# EAGLE design MStar-WLAN (EAGLE 9.6.2)
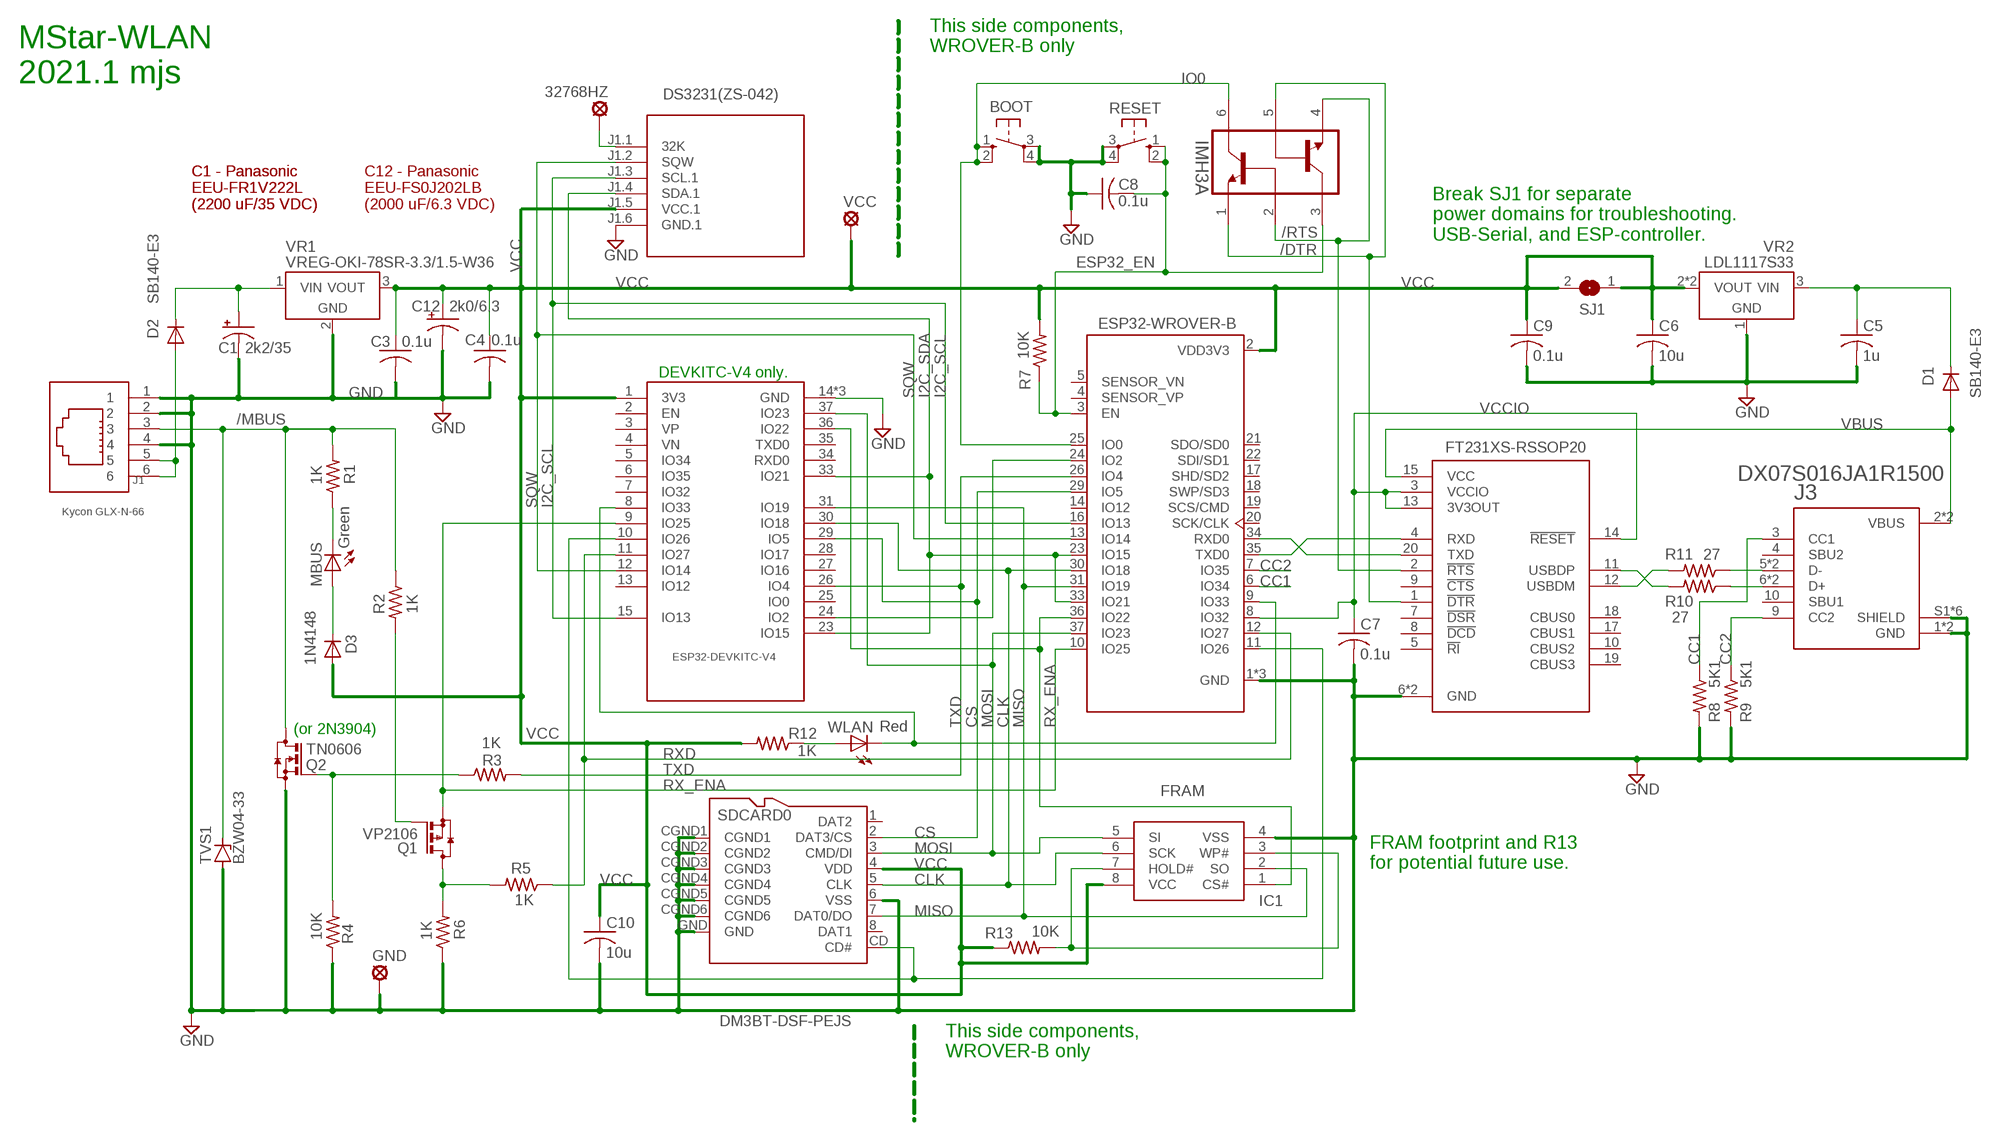
[diagram p0: schematic, sheet 1]

## Parts
32768HZ  MCS10B  [MCS10B]
BOOT  PTS645SM432LFS  10-XX  [B3F-10XX]
C1  2k2/35  CPOL-USE5-4  [E5-4]
C3  0.1u  C-US025-024X044  [C025-024X044]
C4  0.1u  C-US025-024X044  [C025-024X044]
C5  1u  C-USC1206  [C1206]
C6  10u  C-USC1206  [C1206]
C7  0.1u  C-US025-024X044  [C025-024X044]
C8  0.1u  C-US025-024X044  [C025-024X044]
C9  0.1u  C-US025-024X044  [C025-024X044]
C10  10u  C-USC1206  [C1206]
C12  2k0/6.3  CPOL-USE5-6  [E5-6]
D1  SB140-E3  DIODE-DO41-7.6  [DO41-7.6]
D2  SB140-E3  DIODE-DO41-7.6  [DO41-7.6]
D3  1N4148  1N4148DO35-7  [DO35-7]
DS3231(ZS-042)  RTC-DS3231-AT24C32-6  [RTC-DS3231-AT24C32-6]
ESP32-WROVER-B  ESP32-WROVER-I  [XCVR_ESP32-WROVER-I]
FT231XS  FT231XS-RSSOP20  [SSOP20]
GND  MCS10B  [MCS10B]
IC1  FRAM  MR45V100AMAZAATLSO8M  [SO-08M]
IMH3A  IMH3ATSOP6  [TSOP6]
J1  Kycon GLX-N-66  6P6C  [6P6C]
J3  DX07S016JA1R1500  [JAE_DX07S016JA1R1500]
MBUS  Green  LED3MM  [LED3MM]
Q1  VP2106  [TO92]
Q2  TN0606  [TO92]
R1  1K  R-US_  [0204/5]
R2  1K  R-US_  [0204/5]
R3  1K  R-US_  [0204/5]
R4  10K  R-US_  [0204/5]
R5  1K  R-US_  [0204/5]
R6  1K  R-US_  [0204/5]
R7  10K  R-US_  [0204/5]
R8  5K1  R-US_  [0204/5]
R9  5K1  R-US_  [0204/5]
R10  27  R-US_  [0204/5]
R11  27  R-US_  [0204/5]
R12  1K  R-US_  [0204/5]
R13  10K  R-US_R1206  [R1206]
RESET  PTS645SM432LFS  10-XX  [B3F-10XX]
SDCARD0  DM3BT-DSF-PEJS  [DM3BT-DSF-PEJS]
SJ1  SJ  [SJ]
TVS1  BZW04-33  ZPY  [DO41Z10]
U$1  ESP32-DEVKITC-V4-NOSD  [ESP32-DEVKITC-V4-NOSD]
VCC  MCS10B  [MCS10B]
VR1  VREG-OKI-78SR-3.3/1.5-W36  [OKI-78SR]
VR2  LDL1117S33  VREG-TS1117CW-3V3  [SOT223]
WLAN  Red  LED3MM  [LED3MM]

## Nets
/DTR: FT231XS.1(!DTR) IMH3A.1(Q1E) IMH3A.5(Q2B)
/MBUS: J1.3 Q2.D R1.2 R2.1 TVS1.C
/RTS: FT231XS.2(!RTS) IMH3A.2(Q1B) IMH3A.4(Q2E)
CC1: ESP32-WROVER-B.6(IO34) J3.3(CC1) R8.1
CC2: ESP32-WROVER-B.7(IO35) J3.9(CC2) R9.1
CD: ESP32-WROVER-B.11(IO26) SDCARD0.CD(CD#) U$1.10(IO26)
CLK: ESP32-WROVER-B.30(IO18) IC1.6(SCK) SDCARD0.5(CLK) U$1.30(IO18)
CS: ESP32-WROVER-B.29(IO5) SDCARD0.2(DAT3/CS) U$1.29(IO5)
ESP32_EN: C8.2 ESP32-WROVER-B.3(EN) IMH3A.3(Q2C) R7.1 RESET.1(S) RESET.2(S1)
GND [PWR]: BOOT.3(P) BOOT.4(P1) C1.- C3.2 C4.2 C5.2 C6.2 C7.2 C8.1 C9.2 C10.2 C12.- DS3231(ZS-042).J1.6(GND.1) ESP32-WROVER-B.1(GND) ESP32-WROVER-B.15(GND) ESP32-WROVER-B.38(GND) FT231XS.6(GND) FT231XS.16(GND) GND.MP IC1.4(VSS) J1.1 J1.2 J1.4 J3.1(GND) J3.12(GND) J3.S1(SHIELD) J3.S2(SHIELD) J3.S3(SHIELD) J3.S4(SHIELD) J3.S5(SHIELD) J3.S6(SHIELD) Q2.S R4.1 R6.1 R8.2 R9.2 RESET.3(P) RESET.4(P1) SDCARD0.6(VSS) SDCARD0.CGND1 SDCARD0.CGND2 SDCARD0.CGND3 SDCARD0.CGND4 SDCARD0.CGND5 SDCARD0.CGND6 SDCARD0.GND TVS1.A U$1.14(GND) U$1.32(GND) U$1.38(GND) VR1.2(GND) VR2.1(GND)
I2C_SCL: DS3231(ZS-042).J1.3(SCL.1) ESP32-WROVER-B.16(IO13) U$1.15(IO13)
I2C_SDA: DS3231(ZS-042).J1.4(SDA.1) ESP32-WROVER-B.23(IO15) ESP32-WROVER-B.33(IO21) U$1.23(IO15) U$1.33(IO21)
IO0: BOOT.1(S) BOOT.2(S1) ESP32-WROVER-B.25(IO0) IMH3A.6(Q1C)
MISO: ESP32-WROVER-B.31(IO19) IC1.2(SO) SDCARD0.7(DAT0/DO) U$1.31(IO19)
MOSI: ESP32-WROVER-B.37(IO23) IC1.5(SI) SDCARD0.3(CMD/DI) U$1.37(IO23)
N$1: MBUS.K(C) R1.1
N$2: Q2.G R3.1 R4.2
N$3: Q1.G R2.2
N$5: 32768HZ.MP DS3231(ZS-042).J1.1(32K)
N$6: ESP32-WROVER-B.36(IO22) IC1.1(CS#) U$1.36(IO22)
N$7: IC1.3(WP#) IC1.7(HOLD#) R13.2
N$8: D3.C MBUS.A
N$9: ESP32-WROVER-B.24(IO2) U$1.24(IO2)
N$12: Q1.D R5.2 R6.2
N$14 [PWR]: D2.A J1.5 J1.6
N$17 [PWR]: C5.1 D1.C VR2.3(VIN)
N$18: R12.1 WLAN.A
RAW12 [PWR]: C1.+ D2.C VR1.1(VIN)
RX_ENA: ESP32-WROVER-B.10(IO25) Q1.S U$1.9(IO25)
RXD: ESP32-WROVER-B.12(IO27) R5.1 U$1.11(IO27)
RXD0: ESP32-WROVER-B.34(RXD0) FT231XS.20(TXD)
SQW: DS3231(ZS-042).J1.2(SQW) ESP32-WROVER-B.13(IO14) U$1.12(IO14)
TXD: ESP32-WROVER-B.26(IO4) R3.2 U$1.26(IO4)
TXD0: ESP32-WROVER-B.35(TXD0) FT231XS.4(RXD)
USBD+: J3.6(D+) J3.7(D+) R10.1
USBD-: J3.5(D-) J3.8(D-) R11.1
USBDM: FT231XS.12(USBDM) R11.2
USBDP: FT231XS.11(USBDP) R10.2
VBUS [PWR]: D1.A FT231XS.15(VCC) J3.2(VBUS) J3.11(VBUS)
VCC [PWR]: C3.1 C4.1 C6.1 C9.1 C10.1 C12.+ D3.A DS3231(ZS-042).J1.5(VCC.1) ESP32-WROVER-B.2(VDD3V3) IC1.8(VCC) R7.2 R12.2 R13.1 SDCARD0.4(VDD) SJ1.1 SJ1.2 U$1.1(3V3) VCC.MP VR1.3(VOUT) VR2.2(VOUT) VR2.4(VOUT)
VCCIO: C7.1 ESP32-WROVER-B.8(IO32) FT231XS.3(VCCIO) FT231XS.13(3V3OUT) FT231XS.14(!RESET)
WLAN_LED: ESP32-WROVER-B.9(IO33) U$1.8(IO33) WLAN.K(C)
Unconnected: ESP32-WROVER-B.4(SENSOR_VP) ESP32-WROVER-B.5(SENSOR_VN) ESP32-WROVER-B.14(IO12) ESP32-WROVER-B.17(SHD/SD2) ESP32-WROVER-B.18(SWP/SD3) ESP32-WROVER-B.19(SCS/CMD) ESP32-WROVER-B.20(SCK/CLK) ESP32-WROVER-B.21(SDO/SD0) ESP32-WROVER-B.22(SDI/SD1) FT231XS.5(!RI) FT231XS.7(!DSR) FT231XS.8(!DCD) FT231XS.9(!CTS) FT231XS.10(CBUS2) FT231XS.17(CBUS1) FT231XS.18(CBUS0) FT231XS.19(CBUS3) J3.4(SBU2) J3.10(SBU1) SDCARD0.1(DAT2) SDCARD0.8(DAT1) U$1.2(EN) U$1.3(VP) U$1.4(VN) U$1.5(IO34) U$1.6(IO35) U$1.7(IO32) U$1.13(IO12) U$1.25(IO0) U$1.27(IO16) U$1.28(IO17) U$1.34(RXD0) U$1.35(TXD0)

## Notes on the sheet
- This side components,
  WROVER-B only
- MStar-WLAN
  2021.1 mjs
- C1 - Panasonic 
  EEU-FR1V222L 
  (2200 uF/35 VDC)
- C1 - Panasonic 
  EEU-FR1V222L 
  (2200 uF/35 VDC)
- C12 - Panasonic 
  EEU-FS0J202LB 
  (2000 uF/6.3 VDC)
- Break SJ1 for separate
  power domains for troubleshooting.
  USB-Serial, and ESP-controller.
- DEVKITC-V4 only.
- (or 2N3904)
- FRAM footprint and R13
  for potential future use.
- This side components,
  WROVER-B only

## Library data of the parts
32768HZ GND VCC = MStar-WLAN:MCS10B: SOLDER PAD
BOOT RESET = MStar-WLAN:10-XX: TACT SWITCH; MPN: B3F-1000; OC_FARNELL: 176432; OC_NEWARK: 36M3542
C1 = MStar-WLAN:CPOL-US: POLARIZED CAPACITOR, American symbol
C3-C10 = MStar-WLAN:C-US: CAPACITOR, American symbol
C12 = rcl:CPOL-US: POLARIZED CAPACITOR, American symbol; SPICEPREFIX: C
D1 D2 = MStar-WLAN:DIODE-: DIODE
D3 = MStar-WLAN:1N4148: DIODE high speed (Philips)
DS3231(ZS-042) = MStar-WLAN:RTC-DS3231-AT24C32-6: RTC Module with Battery and EEPROM based on DS3231 and AT24C32 chips Tutorial can be found here: https://edwardmallon.wordpress.com/2014/05/21/using-a-cheap-3-ds3231-rtc-at24c32-eeprom-from-ebay/ Click here to find device on ebay.com <http://www.ebay.com/sch/DS3231+AT24C32+module>
ESP32-WROVER-B = MStar-WLAN:ESP32-WROVER-I: Module: combo; GPIO, I2C x2, I2S x2, SDIO, SPI x3, UART x3; U.FL; AVAILABILITY: Unavailable; DESCRIPTION: Module: combo; GPIO, I2C x2, I2S x2, SDIO, SPI x3, UART x3; U.FL; MF: Espressif Systems; MP: ESP32-WROVER-I; PACKAGE: Module Espressif Systems; PRICE: None
FT231XS = MStar-WLAN:FT231XS-R: USB Full Speed to Full Handshake UART with USB Charger Detection; DESCRIPTION: USB Full Speed to Full Handshake UART with USB Charger Detection; DIGI-KEY_PART_NUMBER: 768-1129-1-ND; DIGI-KEY_PURCHASE_URL: https://www.digikey.com/product-detail/en/ftdi-future-technology-devices-international-ltd/FT231XS-R/768-1129-1-ND/3029151?utm_source=snapeda&utm_medium=aggregator&utm_campaign=symbol; MF: FTDI,; MP: FT231XS-R; PACKAGE: SSOP-20 FTDI
IC1 = MStar-WLAN:MR45V100AMAZAATL: FRAM
IMH3A = MStar-WLAN:IMH3A: https://www.mouser.com/ProductDetail/755-IMH3AT110
J1 = MStar-WLAN:6P6C: Kycon GLX-N-66 BLX-N-66 Wurth 615006138421
J3 = MStar-WLAN:DX07S016JA1R1500: USB-C (USB TYPE-C) USB 2.0 Receptacle Connector 24 (16+8 Dummy) Position Surface Mount, Right Angle; Through Hole Check prices <https://pricing.snapeda.com/parts/DX07S016JA1R1500/JAE%20Electronics/view-part?ref=eda>; AVAILABILITY: Warning; DESCRIPTION: USB-C (USB TYPE-C) USB 2.0 Receptacle Connector 24 (16+8 Dummy) Position Surface Mount, Right Angle; Through Hole; MF: JAE Electronics; MP: DX07S016JA1R1500; PACKAGE: None; PRICE: None; PURCHASE-URL: https://pricing.snapeda.com/search/part/DX07S016JA1R1500/?ref=eda
MBUS WLAN = MStar-WLAN:LED: LED OSRAM: - CHIPLED LG R971, LG N971, LY N971, LG Q971, LY Q971, LO R971, LY R971 LH N974, LH R974 LS Q976, LO Q976, LY Q976 LO Q996 - Hyper CHIPLED LW Q18S LB Q993, LB Q99A, LB R99A - SideLED LS A670, LO A670, LY A670, LG A670, LP A670 LB A673, LV A673, LT A673, LW A673 LH A674 LY A675 LS A676, LA A676, LO A676, LY A676, LW A676 LS A679, LY A679, LG A679 - Hyper Micro SIDELED® LS Y876, LA Y876, LO Y876, LY Y876 LT Y87S - SmartLED LW L88C, LW L88S LB L89C, LB L89S, LG L890 LS L89K, LO L89K, LY L89K LS L896, LA L896, LO L896, LY L896 - TOPLED LS T670, LO T670, LY T670, LG T670, LP T670 LSG T670, LSP T670, LSY T670, LOP T670, LYG T670 LG T671, LOG T671, LSG T671 LB T673, LV T673, LT T673, LW T673 LH T674 LS T676, LA T676, LO T676, LY T676, LB T676, LH T676, LSB T676, LW T676 LB T67C, LV T67C, LT T67C, LS T67K, LO T67K, LY T67K, LW E67C LS E67B, LA E67B, LO E67B, LY E67B, LB E67C, LV E67C, LT E67C LW T67C LS T679, LY T679, LG T679 LS T770, LO T770, LY T770, LG T770, LP T770 LB T773, LV T773, LT T773, LW T773 LH T774 LS E675, LA E675, LY E675, LS T675 LS T776, LA T776, LO T776, LY T776, LB T776 LHGB T686 LT T68C, LB T68C - Hyper Mini TOPLED® LB M676 - Mini TOPLED Santana® LG M470 LS M47K, LO M47K, LY M47K Source: http://www.osram.convergy.de/
Q1 = MStar-WLAN:VP2106: P-channel enhancement MOSFET
Q2 = MStar-WLAN:TN0606: N-channel enhancement MOSFET, Supertex
R1-R12 = MStar-WLAN:R-US_: RESISTOR, American symbol
R13 = rcl:R-US_: RESISTOR, American symbol; SPICEPREFIX: R
SDCARD0 = MStar-WLAN:DM3BT-DSF-PEJS: HIROSE - microSD Card socket - Reverse on-Board - Push / Push; AVAILABILITY: Unavailable; DESCRIPTION: 10 _8 + 2_ Position Card Connector Secure Digital - microSD™ Surface Mount, Right Angle Gold; MF: Hirose; MP: DM3BT-DSF-PEJS; PACKAGE: None; PRICE: None
SJ1 = jumper:SJ: SMD solder JUMPER
TVS1 = diode:ZPY: Z DIODE 1 W
U$1 = MStar-WLAN:ESP32-DEVKITC-V4-NOSD
VR1 VR2 = MStar-WLAN:VREG: Voltage Regulator LDOs Taiwan Semi TS1117 800mA max 15V - compatible On Semi NCP1117 1A max 20V - compatible Diodes AP2111H 0.6A max 6V (0.25V@0.6A) - compatible Diodes AP2114H 1A max 6V (0.45V@1A) Taiwan Semi TS9011 250mA max 12V - compatible Diodes AP2210 300mA max 15V - compatible Microchip MCP1700 250mA max 6.5V - compatible Microchip MCP1702 250mA max 13V - compatible Microchip MCP1703 250mA max 16V - compatible Microchip MCP1754 150mA max 16V Taiwan Semi TS5204 80mA max 16V (low noise) DC/DC Converter Modules Recom R-78Ex.x-1.0-W36 1A max 28V - compatible CUI V78xx-2000 2A max 18V Murata OKI-78SR-x.x/1.5-W36 1.5A max 36V

## Net classes
1 PWR: width 0.457 mm, drill 0.406 mm, clearance 0.152 mm

## Board
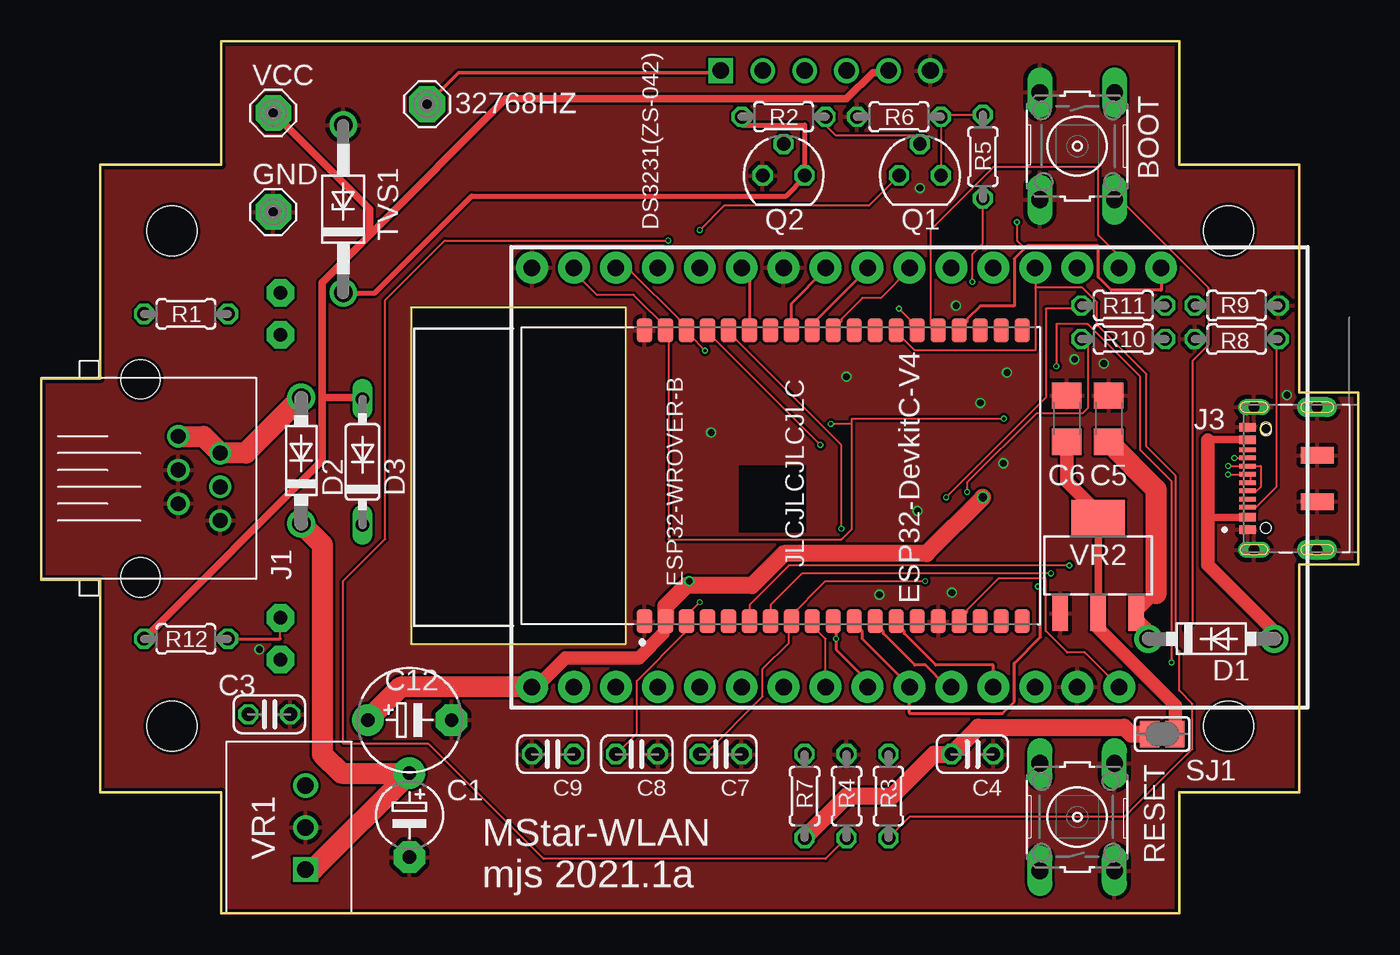
[diagram p1: board, top side]
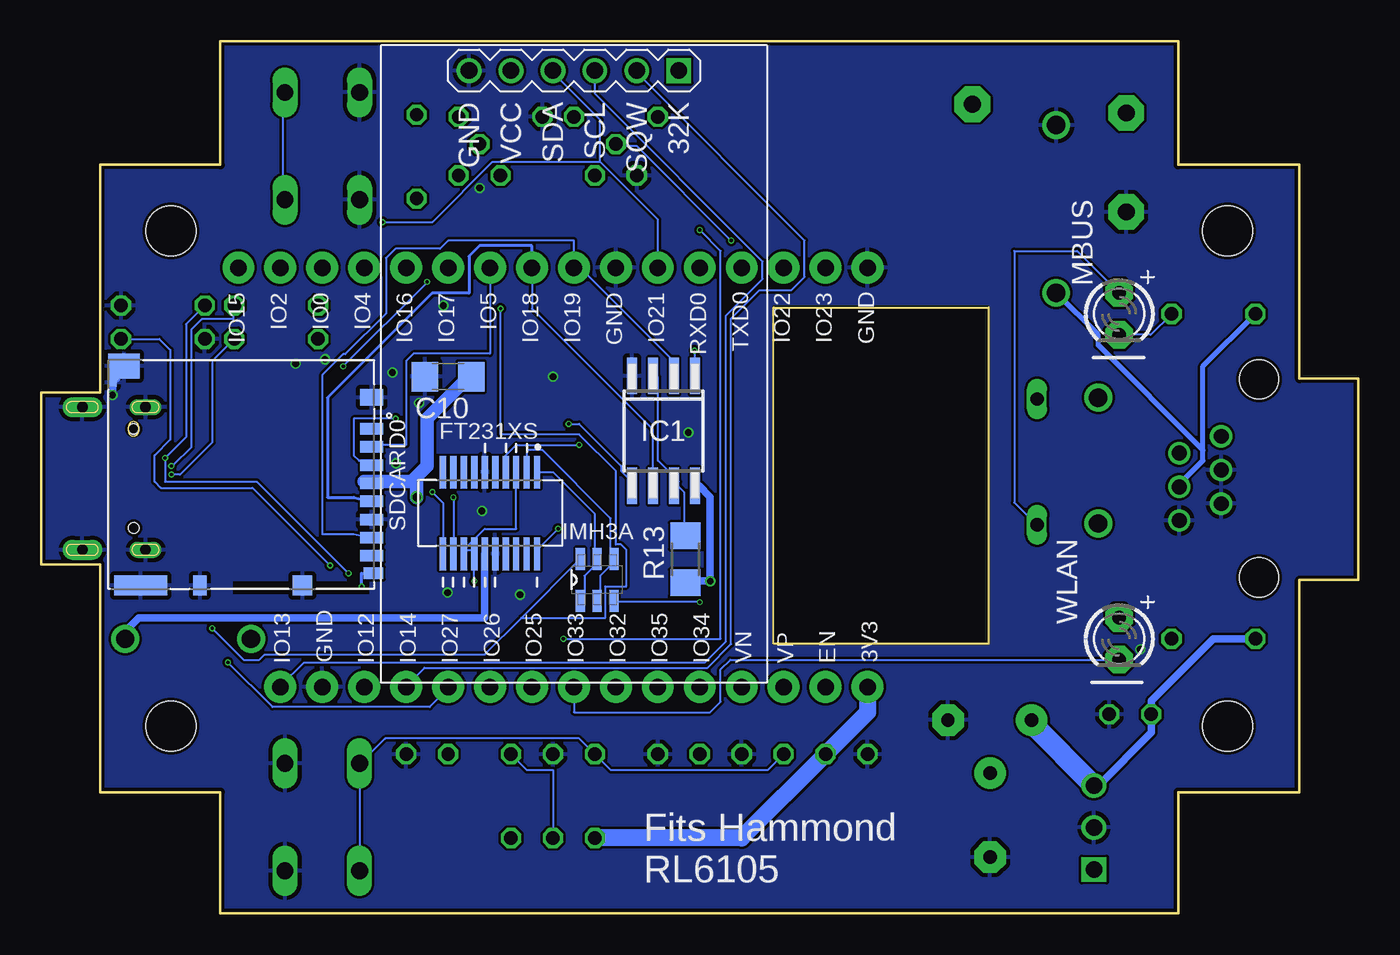
[diagram p2: board, bottom side, seen from below]

Size 79.76 x 52.83 mm. Coordinates in mm from the lower left corner, seen from the top.
Outline: 3.56,7.35 3.56,20.19 0,20.19 0,32.39 3.56,32.39 3.56,45.35 10.91,45.35 10.91,52.83 68.91,52.83 68.91,45.35 76.2,45.35 76.2,31.55 79.76,31.55 79.76,21.15 76.2,21.15 76.2,7.35 68.91,7.35 68.91,0 10.91,0 10.91,7.35 3.56,7.35
Copper layers (1*16): Top 0.035mm / dielectric 1.6mm / Bottom 0.035mm
Design rules "jlcpcb": minimum track width 5mil, minimum drill 8mil, track to track 5mil, track to pad 5mil, pad to pad 5mil, via to via 5mil, smd to smd 0mil, copper to edge 8mil, drill to drill 8mil, minimum pad ring 3mil, minimum via ring 3mil, stop-mask expansion 0mil, vias tented up to drill 100mil, thermal gap 10mil
Holes 3 mm at 7.91,11.35 7.91,41.35 71.91,11.35 71.91,41.35
tRestrict: area 22.4,16.3 to 35.4,36.8
bRestrict: area 22.4,16.3 to 35.4,36.8
Milling: 4 lines

### Footprints (pad centres in the part's own frame; a part is rotated, then mirrored left to right if it is on the bottom)
MCS10B = drill 1.016 pad 2.159 octagon: MP 0,0
B3F-10XX = drill 1.016 long: 1 -3.251,2.261; 2 3.251,2.261; 3 -3.251,-2.261; 4 3.251,-2.261
E5-4 = drill 0.813 pad 1.905: + -2.54,0 | drill 0.813 pad 1.905 octagon: - 2.54,0
C025-024X044 = drill 0.813 octagon: 1 -1.27,0; 2 1.27,0
C1206 = smd 1.6 x 1.8: 1 -1.4,0; 2 1.4,0
E5-6 = drill 0.813 pad 1.905: + -2.54,0 | drill 0.813 pad 1.905 octagon: - 2.54,0
DO41-7.6 = drill 1.1 pad 1.7: A 3.81,0; C -3.81,0
DO35-7 = drill 0.813 long: A 3.81,0; C -3.81,0
RTC-DS3231-AT24C32-6 = drill 1 square: J1.1 -17.78,6.35 | drill 1: J1.2 -17.78,3.81; J1.3 -17.78,1.27; J1.4 -17.78,-1.27; J1.5 -17.78,-3.81; J1.6 -17.78,-6.35
XCVR_ESP32-WROVER-I = smd 1.45 x 0.93: 1 -8.81,8.26; 2 -8.81,6.99; 3 -8.81,5.72; 4 -8.81,4.45; 5 -8.81,3.18; 6 -8.81,1.91; 7 -8.81,0.64; 8 -8.81,-0.63; 9 -8.81,-1.9; 10 -8.81,-3.17; 11 -8.81,-4.44; 12 -8.81,-5.71; 13 -8.81,-6.98; 14 -8.81,-8.25; 15 -8.81,-9.52; 16 -8.81,-10.79; 17 -8.81,-12.06; 18 -8.81,-13.33; 19 -8.81,-14.6; 20 8.81,-14.6; 21 8.81,-13.33; 22 8.81,-12.06; 23 8.81,-10.79; 24 8.81,-9.52; 25 8.81,-8.25; 26 8.81,-6.98; 27 8.81,-5.71; 28 8.81,-4.44; 29 8.81,-3.17; 30 8.81,-1.9; 31 8.81,-0.63; 32 8.81,0.64; 33 8.81,1.91; 34 8.81,3.18; 35 8.81,4.45; 36 8.81,5.72; 37 8.81,6.99; 38 8.81,8.26
SSOP20 = smd 1.97 x 0.41: 1 -2.47,2.857; 2 -2.47,2.223; 3 -2.47,1.587; 4 -2.47,0.953; 5 -2.47,0.318; 6 -2.47,-0.318; 7 -2.47,-0.953; 8 -2.47,-1.587; 9 -2.47,-2.223; 10 -2.47,-2.857; 11 2.47,-2.857; 12 2.47,-2.223; 13 2.47,-1.587; 14 2.47,-0.953; 15 2.47,-0.318; 16 2.47,0.318; 17 2.47,0.953; 18 2.47,1.587; 19 2.47,2.223; 20 2.47,2.857
SO-08M = smd 0.6 x 2.2: 1 -1.905,-3.33; 2 -0.635,-3.33; 3 0.635,-3.33; 4 1.905,-3.33; 5 1.905,3.33; 6 0.635,3.33; 7 -0.635,3.33; 8 -1.905,3.33
TSOP6 = smd 1.321 x 0.559: 1 -1.27,1.016; 2 -1.27,0; 3 -1.27,-1.016; 4 1.27,-1.016; 5 1.27,0; 6 1.27,1.016
6P6C = drill 0.9: 1 -5.76,2.55; 2 -3.22,1.53; 3 -5.76,0.51; 4 -3.22,-0.51; 5 -5.76,-1.53; 6 -3.22,-2.55 | hole 2.36: -0.92,-6; -0.92,6
JAE_DX07S016JA1R1500 = smd 0.52 x 1: 1 -3.1,1.1; 2 -2.35,1.1; 11 2.35,1.1; 12 3.1,1.1 | smd 0.27 x 1: 3 -1.75,1.1; 4 -1.25,1.1; 5 -0.75,1.1; 6 -0.25,1.1; 7 0.25,1.1; 8 0.75,1.1; 9 1.25,1.1; 10 1.75,1.1 | smd 1 x 2: S1 -1.4,-3.1; S2 1.4,-3.1 | drill 0.65 long: S3 -4.32,0.725; S4 4.32,0.725 | drill 0.65 pad 1.2 long: S5 -4.32,-3.1; S6 4.32,-3.1 | hole 0.6: 3,0 | hole 0.63: 3,0; -3,0
LED3MM = drill 0.813 pad 1.676 octagon: A -1.27,0; K 1.27,0
TO92 = drill 0.813 octagon: D 1.27,0; G 0,1.905; S -1.27,0
0204/5 = drill 0.813 octagon: 1 -2.54,0; 2 2.54,0
R1206 = smd 1.6 x 1.803: 1 -1.422,0; 2 1.422,0
DM3BT-DSF-PEJS = smd 0.7 x 1.4: 1 -3.2,15.95; 2 -2.1,15.95; 3 -1,15.95; 4 0.1,15.95; 5 1.2,15.95; 6 2.3,15.95; 7 3.4,15.95; 8 4.5,15.95 | smd 0.7 x 1.2: CD 5.55,16.05 | smd 0.5 x 0.5: CGND1 -6,0.25 | smd 1.5 x 1.9: CGND2 -7,0.95 | smd 0.21 x 0.21 rotated 45: CGND3 -6.25,0.5 | smd 1 x 1.4: CGND4 -5.1,15.95 | smd 1.2 x 1.2: CGND5 6.3,11.75 | smd 1.2 x 3.2: CGND6 6.3,1.95 | smd 1.2 x 0.8: GND 6.3,5.55
SJ = smd 1.168 x 1.6: 1 -0.762,0; 2 0.762,0
DO41Z10 = drill 1.118: A 5.08,0; C -5.08,0
ESP32-DEVKITC-V4-NOSD = drill 1 pad 1.93: 1 -22.86,-12.7; 2 -20.32,-12.7; 3 -17.78,-12.7; 4 -15.24,-12.7; 5 -12.7,-12.7; 6 -10.16,-12.7; 7 -7.62,-12.7; 8 -5.08,-12.7; 9 -2.54,-12.7; 10 0,-12.7; 11 2.54,-12.7; 12 5.08,-12.7; 13 7.62,-12.7; 14 10.16,-12.7; 15 12.7,-12.7; 23 15.24,12.7; 24 12.7,12.7; 25 10.16,12.7; 26 7.62,12.7; 27 5.08,12.7; 28 2.54,12.7; 29 0,12.7; 30 -2.54,12.7; 31 -5.08,12.7; 32 -7.62,12.7; 33 -10.16,12.7; 34 -12.7,12.7; 35 -15.24,12.7; 36 -17.78,12.7; 37 -20.32,12.7; 38 -22.86,12.7
OKI-78SR = drill 1 pad 1.5 square: 1 -2.54,0 | drill 1 pad 1.5: 2 0,0; 3 2.54,0
SOT223 = smd 0.95 x 2.15: 1 -2.3,-2.9; 2 0,-2.9; 3 2.3,-2.9 | smd 3.25 x 2.15: 4 0,2.9

### Placement (x,y rotation side)
32768HZ  23.37,49.02 0 top
BOOT  62.74,46.48 270 top
C1  22.3,5.95 270 top
C3  13.81,12.07 0 top
C4  56.39,9.65 0 top
C5  64.64,29.97 90 top
C6  62.1,29.97 90 top
C7  41.15,9.65 0 top
C8  36.07,9.65 180 top
C9  30.99,9.65 180 top
C10  55.12,32.51 180 bottom
C12  22.31,11.71 0 top
D1  70.87,16.64 0 top
D2  15.75,27.43 90 top
D3  19.45,27.35 90 top
DS3231(ZS-042)  47.5,33.27 270 bottom
ESP32-WROVER-B  44.8,26.51 90 top
FT231XS  52.58,24.26 270 bottom
GND  14.05,42.49 0 top
IC1  42.07,29.23 180 bottom
IMH3A  46.09,20.21 90 bottom
J1  5.08,26.35 180 top
J3  74.17,26.35 90 top
MBUS  14.48,36.32 270 bottom
Q1  53.21,44.7 0 top
Q2  44.96,44.7 0 top
R1  8.76,36.32 180 top
R2  44.96,48.26 0 top
R3  51.31,7.11 270 top
R4  48.77,7.11 270 top
R5  57.02,45.85 90 top
R6  51.94,48.26 0 top
R7  46.23,7.11 270 top
R8  72.39,34.8 180 top
R9  72.39,36.83 0 top
R10  65.53,34.8 180 top
R11  65.53,36.83 180 top
R12  8.76,16.64 180 top
R13  40.75,21.46 90 bottom
RESET  62.74,5.84 90 top
SDCARD0  75.69,26.16 270 bottom
SJ1  67.89,10.87 180 top
TVS1  18.29,42.67 90 top
U$1  52.58,26.42 0 top
VCC  14.05,48.49 0 top
VR1  16,5.21 90 top
VR2  64.01,21.08 0 top
WLAN  14.48,16.64 270 bottom

### Tracks (layer width: path | path; a pad name or v marks a point on that pad's centre or on a via)
/DTR
  Bottom 0.127: IMH3A.1 46.86,19.18 46.86,20.45 45.91,21.4 IMH3A.5 46.23,21.72 46.23,24.2 48.75,26.73 FT231XS.1
/MBUS
  Top 0.127: 46.23,44.58 Q2.D
  Top 0.305: Q2.D 46.23,47.75 42.42,47.75 R2.1 | 46.23,44.58 45.12,43.46 26.07,43.46 20.19,37.59 TVS1.C
  Bottom 0.305: R1.2 9.4,33.15 9.4,28.07 | 9.4,28.07 9.4,27.43 10.67,26.16 J1.3 | TVS1.C 15.75,35.05 15.75,34.42 9.4,28.07
/RTS
  Bottom 0.127: IMH3A.2 45.91,19.18 45.91,20.45 44.96,21.4 IMH3A.4 45.27,21.72 45.27,23.94 49.4,28.07 50.36,28.07 FT231XS.2
CC1  (via drill 0.2)
  Top 0.127: v62.26,21.08 45.27,21.08 42.89,18.7 42.89,17.75 ESP32-WROVER-B.6 | J3.3 73.22,24.57 73.53,24.57 74.8,25.84 74.8,34.73 R8.1
  Bottom 0.127: v62.26,21.08 66.97,25.79 72.52,25.79 72.9,26.16 72.9,27.75 71.95,28.7 71.95,34.14 72.6,34.8 R8.1
CC2  (via drill 0.2)
  Top 0.127: v72.26,27.59 J3.9 | v61.15,20.61 46.07,20.61 44.16,18.7 44.16,17.75 ESP32-WROVER-B.7
  Bottom 0.127: R9.1 70.99,35.69 70.99,28.86 v72.26,27.59 72.26,26.16 66.71,26.16 v61.15,20.61
CD  (via drill 0.2)
  Top 0.178: v60.36,19.81 60.52,19.65 60.52,16.75 58.93,15.16 58.93,12.83 58.22,12.12 52.58,12.12 U$1.10 52.58,13.78 49.72,16.64 49.72,17.11 49.24,17.59 ESP32-WROVER-B.11
  Bottom 0.178: v60.36,19.81 60.36,20.61 SDCARD0.CD
CLK
  Top 0.178: U$1.30 50.04,39.02 46.7,35.69 46.7,35.37 ESP32-WROVER-B.30
  Bottom 0.127: U$1.30 50.04,36.64 42.74,29.34 42.74,26.16 IC1.6
  Bottom 0.178: U$1.30 50.04,40.45 53.21,40.45 53.85,39.81 53.85,37.56 56.1,37.56 62.42,31.24 62.42,25.21 60.83,25.21 SDCARD0.5
CS
  Top 0.127: ESP32-WROVER-B.29 47.97,35.37 48.45,35.85 48.45,36 49.73,37.28 50.84,37.28 52.58,39.02 U$1.29
  Bottom 0.127: U$1.29 52.58,33.9 57.22,33.9 57.66,33.46 57.66,28.38 60.2,28.38 SDCARD0.2
ESP32_EN  (via drill 0.2)
  Top 0.127: C8.2 36.07,10.92 36.07,14.1 38.93,16.95 38.93,17.59 ESP32-WROVER-B.3 39.24,17.91 39.24,18.23 v39.88,18.86
  Bottom 0.127: C8.2 35.75,8.7 45.27,8.7 R7.1 47.18,10.61 58.93,10.61 60.2,9.33 RESET.2 RESET.1 | v39.88,18.86 44.96,18.86 IMH3A.3
GND  (via drill 0.41)
  Bottom 0.457: SDCARD0.CGND3 75.28,32.35 75.44,32.2 SDCARD0.CGND1 75.44,32.04 v75.44,31.4
  other vias: 13.21,16 53.21,43.94 55.4,36.82 62.57,33.57 64.36,33.31 55.14,19.44 58.26,27.27 48.77,32.51 58.49,32.77 53.07,24.38 50.76,19.31 56.88,30.93 40.57,29.14
  pour Top: -5.21,57.28 84.33,57.28 84.33,-5.59 -5.84,-5.59
  pour Bottom: -6.48,58.55 85.6,58.55 85.6,-7.49 -7.75,-7.49 -7.75,58.55
I2C_SCL
  Top 0.127: U$1.15 63.19,15.8 62.14,15.8 60.83,17.11 60.83,20.29 57.98,20.29 56.07,18.38 56.07,18.23 55.59,17.75 ESP32-WROVER-B.16
  Bottom 0.127: DS3231(ZS-042).J1.3 46.23,49.66 36.07,39.5 36.07,38.44 38.29,36.21 38.29,16.48 39.56,15.21 63.85,15.21 65.28,13.78 U$1.15
I2C_SDA  (via drill 0.2)
  Top 0.127: 59.56,40.29 59.09,40.77 v59.09,41.88
  Top 0.178: U$1.23 67.82,37.75 64.8,37.75 64.01,38.54 64.01,40.45 59.72,40.45 59.56,40.29 58.93,39.66 58.93,36.81 56.87,36.81 56.07,36 56.07,35.85 55.59,35.37 ESP32-WROVER-B.23 | ESP32-WROVER-B.33 42.89,35.37 42.89,38.54 42.42,39.02 U$1.33
  Bottom 0.127: 45.91,45.53 45.91,48.07 48.77,50.93 DS3231(ZS-042).J1.4 | 45.91,45.53 42.42,42.04 U$1.33 | 45.91,45.53 52.42,45.53 56.07,41.88 v59.09,41.88
IO0  (via drill 0.2)
  Top 0.127: v69.41,17.27 69.72,17.59 69.72,33.46 70.67,34.42 70.67,37.91 65.28,43.31 BOOT.2 | v51.94,36.64 52.58,36 52.58,35.69 52.9,35.37 ESP32-WROVER-B.25
  Bottom 0.127: BOOT.1 65.12,49.66 65.12,43.31 BOOT.2 | 50.67,17.91 52.9,15.68 66.23,15.68 66.55,15.37 67.5,15.37 v69.41,17.27 | 50.67,17.91 47.18,21.4 IMH3A.6 | v51.94,36.64 51.94,29.02 47.18,29.02 44.96,26.8 44.96,22.35 44.64,22.35 44.32,22.04 44.32,19.81 45.59,19.81 45.59,17.91 50.67,17.91
MISO
  Top 0.178: U$1.31 47.5,39.02 45.43,36.96 45.43,35.37 ESP32-WROVER-B.31
  Bottom 0.127: 47.5,39.5 47.5,40.77 55.12,40.77 55.61,40.27 58.3,40.27 58.88,39.7 58.88,36.34 61.34,33.88 61.47,33.88 62.74,32.61 62.74,22.99 60.83,22.99 SDCARD0.7 | 47.5,39.5 41.47,33.46 41.47,32.83 IC1.2 | 47.5,39.5 U$1.31
MOSI  (via drill 0.2)
  Top 0.127: U$1.37 32.26,38.86 33.66,37.46 35.88,37.46 37.97,35.37 ESP32-WROVER-B.37 37.97,35.05 37.97,22.67 48.45,22.67 49.09,23.3 49.09,29.66 | v58.29,29.97 49.09,29.97 49.09,29.66 | 49.09,29.66 v47.82,29.66
  Bottom 0.127: v58.29,29.97 60.83,29.97 60.83,27.75 60.52,27.43 59.88,27.43 SDCARD0.3 | v47.82,29.66 47.18,29.66 44.64,27.11 44.64,26.8 44.01,26.16 IC1.5
N$1
  Bottom 0.127: R1.1 12.57,35.05 MBUS.K
N$2  (via drill 0.2)
  Top 0.127: v37.97,40.77 24.44,40.77 20.83,37.16 20.83,22.68 18.29,20.14 18.29,10.29 23.45,10.29 30.43,3.3 47.5,3.3 R4.2
  Bottom 0.127: R4.2 48.77,8.7 50.36,8.7 R3.1 | v37.97,40.77 43.69,46.48 44.96,46.48 Q2.G
N$3
  Top 0.127: R2.2 47.5,47.75 48.13,47.12 53.21,47.12 Q1.G
N$5
  Top 0.127: 41.15,50.93 DS3231(ZS-042).J1.1
  Top 0.203: 41.15,50.93 25.27,50.93 32768HZ.MP
N$6  (via drill 0.2)
  Top 0.127: U$1.36 34.8,38.86 35.75,38.86 38.61,36 38.61,35.69 38.93,35.37 ESP32-WROVER-B.36 39.24,35.05 v40.2,34.1
  Bottom 0.127: v40.2,34.1 40.2,32.83 IC1.1
N$7
  Bottom 0.127: R13.2 40.83,22.99 40.83,25.53 41.15,25.84 IC1.7 41.15,26.16 42.42,27.43 42.42,32.51 IC1.3
N$8
  Bottom 0.127: D3.C 19.56,23.62 20.83,24.89 20.83,40.13 17.02,40.13 MBUS.A
N$9
  Top 0.127: U$1.24 65.28,39.81 64.01,41.09 64.01,45.21 57.66,45.21 53.85,41.4 53.85,35.69 54.16,35.37 ESP32-WROVER-B.24
N$12
  Top 0.127: Q1.D R6.2 54.48,48.39 R5.2
N$14
  Top 1.27: J1.6 9.82,28.9 J1.5 12.39,27.88 D2.A
N$17
  Top 0.457: 64.64,28.54 C5.1 | 66.55,17.91 66.39,18.07 VR2.3 | 66.39,18.38 VR2.3 | 67.02,19.02 67.5,19.38 | 67.5,16.64 D1.C | 66.55,17.91 66.55,17.59 | 66.55,17.91 VR2.3
  Top 0.813: 67.5,16.64 66.55,17.59 | 67.02,19.02 66.39,18.38
  Top 1.27: 64.64,28.54 67.5,25.69 67.5,19.38
N$18
  Top 0.127: 14.48,16.64 WLAN.A
  Top 0.178: R12.1 14.48,16.64
RAW12
  Top 1.27: D2.C 17.02,22.35 17.02,9.65 18.18,8.49 C1.+ 16.47,2.67 VR1.1
RX_ENA  (via drill 0.2)
  Top 0.127: Q1.S 50.11,42.87 41.35,42.87 v39.88,41.4
  Top 0.178: U$1.9 50.04,14.1 48.13,16 v48.13,16.64 48.13,17.27 ESP32-WROVER-B.10
  Bottom 0.127: v39.88,41.4 38.61,40.13 38.61,16.64 v48.13,16.64
RXD  (via drill 0.2)
  Top 0.127: v68.45,15.21 68.45,26.16 66.55,28.07 66.55,32.51 63.37,35.69 61.47,35.69 v61.47,33.15 | v56.39,38.26 56.39,39.94 57.02,40.57 R5.1
  Top 0.178: ESP32-WROVER-B.12 50.51,17.59 50.99,17.11 50.99,16.95 52.9,15.05 53.53,15.05 54.8,13.78 55.12,13.78 U$1.11
  Bottom 0.127: v68.45,15.21 65.75,12.51 56.23,12.51 55.12,13.62 U$1.11 | v56.39,38.26 56.39,38.23 v61.47,33.15
RXD0  (via drill 0.2)
  Top 0.127: v48.45,23.3 48.45,28.38 41.78,35.05 ESP32-WROVER-B.34
  Bottom 0.127: v48.45,23.3 49.72,22.04 FT231XS.20
SQW
  Top 0.178: U$1.12 57.66,15.05 54.16,15.05 52.26,16.95 52.26,17.11 51.78,17.59 ESP32-WROVER-B.13
  Bottom 0.127: DS3231(ZS-042).J1.2 43.69,50.93 33.53,40.77 33.53,38.56 34.33,37.75 36.25,37.75 37.97,36.03 37.97,16.32 39.4,14.89 56.55,14.89 57.66,13.78 U$1.12
TXD
  Top 0.127: U$1.26 60.2,37.91 | 60.2,37.91 60.2,34.1 52.9,34.1 51.94,35.05 ESP32-WROVER-B.26 | 60.2,37.91 63.06,37.91 63.94,37.03 63.94,35.6 63.96,35.58 64.02,35.58 66.94,32.66 66.94,28.28 68.71,26.51 68.71,16.1 68.93,15.88 68.93,15.84 68.91,15.82 68.91,13.51 69.72,12.69 69.72,9.97 65.59,5.84 52.58,5.84 R3.2
TXD0  (via drill 0.2)
  Top 0.127: v47.18,28.38 40.51,35.05 ESP32-WROVER-B.35
  Bottom 0.127: v47.18,28.38 50.99,28.38 51.63,27.75 FT231XS.4
USBD+  (via drill 0.2)
  Top 0.127: J3.6 73.22,26.16 73.22,26.48 J3.7 73.05,26.59 v71.87,26.59
  Bottom 0.127: v71.87,26.59 71.35,26.59 69.41,28.54 69.41,33.46 R10.1
USBD-  (via drill 0.2)
  Top 0.127: J3.5 73.22,25.53 73.53,25.53 73.85,25.84 73.85,27.11 73.22,27.11 J3.8 73.06,27.1 v71.88,27.1
  Bottom 0.127: 71.73,27.18 70.67,28.23 70.67,35.37 70.04,36 68.14,36 68.14,36.64 R11.1 | 71.73,27.18 v71.88,27.1 | 71.73,27.18
USBDM  (via drill 0.2)
  Top 0.127: v54.8,25.21 60.83,31.24 60.83,36.64 62.74,36.64 R11.2
  Bottom 0.127: v54.8,25.21 FT231XS.12
USBDP  (via drill 0.2)
  Top 0.127: v56.07,25.53 56.07,26.09 60.27,30.29 63.06,30.29 63.37,30.61 63.37,34.73 63.06,34.73 R10.2
  Bottom 0.127: v56.07,25.53 56.07,25.5 55.44,24.87 FT231XS.11
VBUS
  Top 0.457: J3.11 72.42,28.7 70.67,28.7 70.64,28.67 | 75.12,16.64 D1.A | J3.2 70.77,24 70.64,23.88
  Top 0.813: 70.64,28.67 70.64,23.88 70.64,21.11 75.12,16.64
  Bottom 0.457: FT231XS.15 52.9,17.91 73.85,17.91 75.12,16.64 D1.A
VCC  (via drill 0.41, 0.5)
  Top 0.457: 37.66,16.95 37.66,17.59 ESP32-WROVER-B.2 | 64.01,24.26 VR2.4 VR2.2 64.01,17.27 | 29.72,13.46 U$1.1 | 19.88,41.09 17.02,38.23 17.02,31.24 | 19.88,41.09 28.13,49.34 48.77,49.34 50.36,50.93 51.31,50.93 DS3231(ZS-042).J1.5 | 17.02,31.24 17.02,27.43 R12.2 | VCC.MP 19.88,42.66 19.88,41.09 | v39.24,20.13 39.07,19.86 | 17.02,31.24 18.92,31.24 D3.A
  Top 0.508: SJ1.2 SJ1.1
  Top 0.813: 37.66,16.95 36.2,15.5 31.75,15.5 29.72,13.46 | C6.1 62.1,26.16 64.01,24.26 | SJ1.1 68.67,10.89 68.67,12.61 64.01,17.27
  Top 1.016: R7.2 48.78,7.12 51.54,7.12 54.07,9.65 C4.1 56.74,11.28 65.59,11.28 66,10.86 SJ1.2 | ESP32-WROVER-B.2 37.81,18.6 39.07,19.86 43.03,19.86 44.98,21.81 53.62,21.81 v57.02,25.21
  Top 1.27: U$1.1 21.77,13.72 C12.+
  Bottom 0.457: R12.2 8.76,16.64 12.54,12.86 C3.1 12.54,10.96 15.75,7.75 VR1.3 | 57.34,26.16 57.18,26.32 57.02,26.16 | 60.2,26.16 SDCARD0.4 | R13.1 40.51,20.13 v39.24,20.13 39.24,25.24 39.91,25.9 IC1.8 | 54.16,32.2 53.85,32.51 C10.1 54.16,32.2
  Bottom 0.813: 57.34,26.16 60.2,26.16 | 57.18,26.32 56.39,27.11 56.39,29.97 54.16,32.2 | v57.02,25.21 57.02,26.16
  Bottom 1.016: U$1.1 29.72,12.19 C9.1 37.34,4.57 R7.2
  Bottom 1.27: VR1.3 19.77,11.51 C12.+
VCCIO  (via drill 0.2)
  Top 0.127: C7.1 40.2,9.65 43.69,13.14 43.69,14.81 45.27,16.4 45.27,17.59 ESP32-WROVER-B.8 45.27,17.91 47.5,20.13 v53.53,20.13
  Bottom 0.127: 54.16,22.04 53.53,22.04 FT231XS.14 v53.53,20.13 | FT231XS.3 50.99,23.3 52.9,23.3 54.16,22.04 | 54.16,22.04 FT231XS.13
WLAN_LED
  Top 0.127: U$1.8 47.5,16.64 46.86,17.27 ESP32-WROVER-B.9
  Bottom 0.127: U$1.8 47.5,12.19 39.24,12.19 38.61,12.83 38.61,14.79 38.03,15.37 WLAN.K

### Text on the board
tNames: JLCJLCJLCJLC | ESP32-WROVER-B | MStar-WLAN / mjs 2021.1a
bNames: Fits Hammond / RL6105